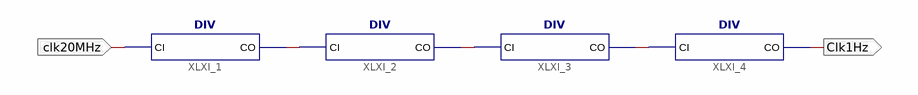
[diagram p0: schematic sheet 1]
// Xilinx ISE schematic CLK1Hz.sch (spartan6) as structural Verilog: 4 symbols, 2 ports
module CLK1Hz (
  input  clk20MHz,
  output Clk1Hz
);

  wire XLXN_1, XLXN_2, XLXN_3;

  DIV XLXI_1 (.CI(clk20MHz), .CO(XLXN_1));
  DIV XLXI_2 (.CI(XLXN_1), .CO(XLXN_2));
  DIV XLXI_3 (.CI(XLXN_2), .CO(XLXN_3));
  DIV XLXI_4 (.CI(XLXN_3), .CO(Clk1Hz));
endmodule
